# EAGLE design BotBoardUSB-R1 (EAGLE 4.16)
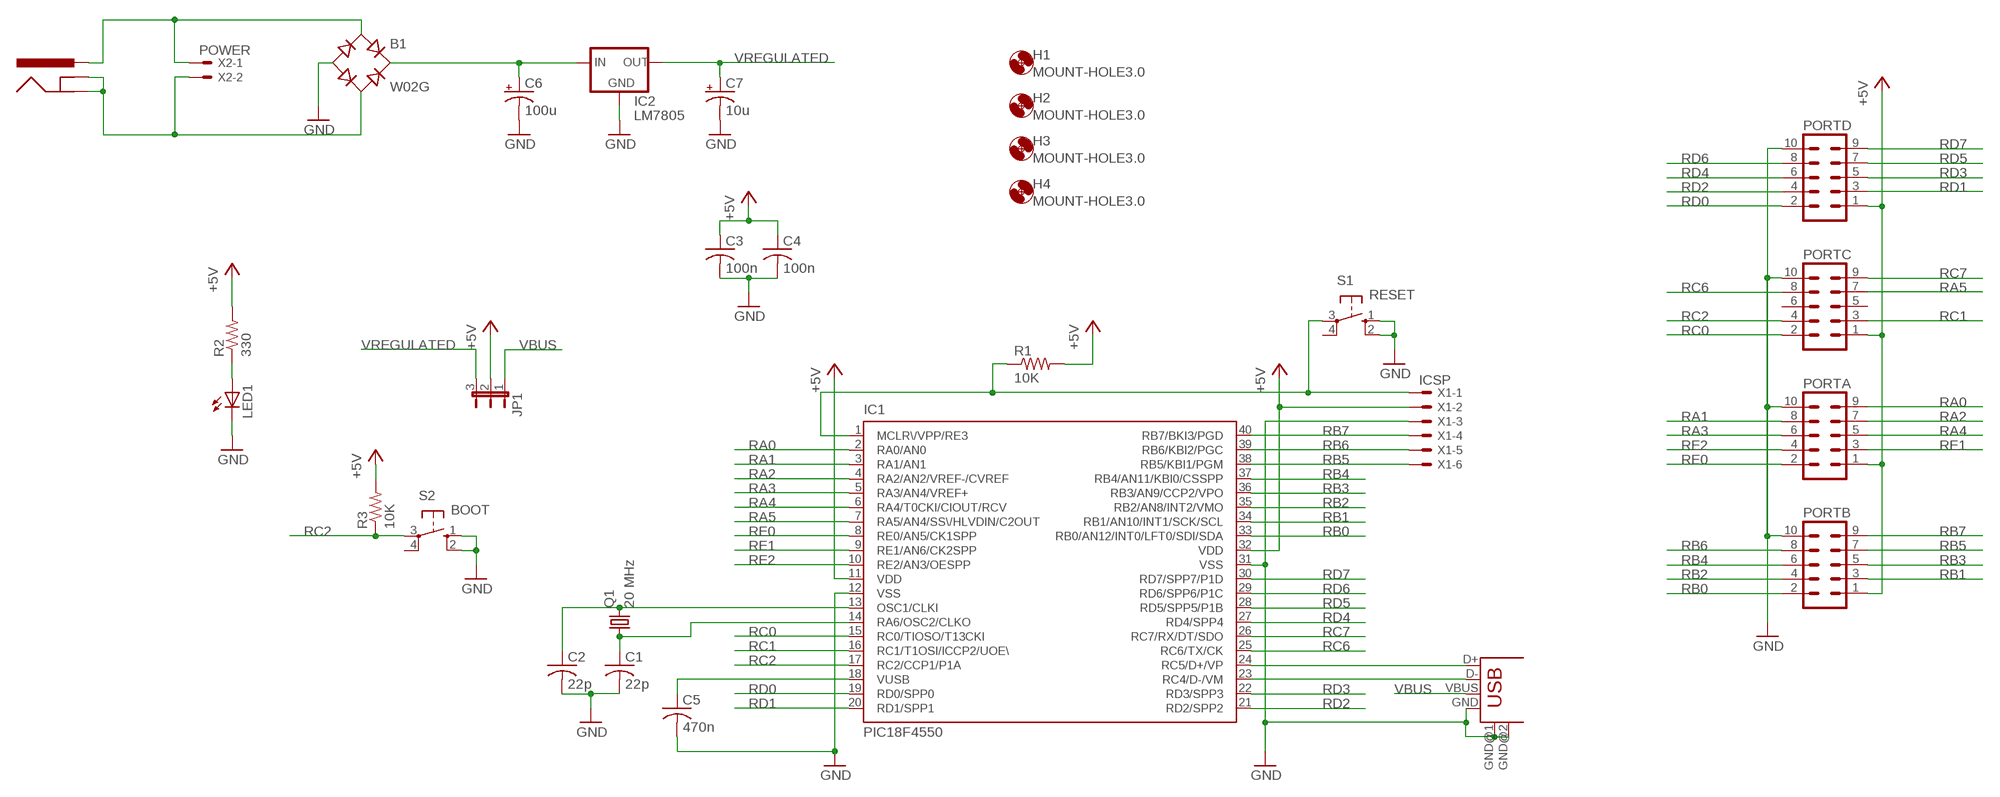
[diagram p0: schematic, sheet 1]

## Parts
B1  W02G  RECTIFIER-RB1A  [RB1A]
C1  22p  C-US025-025X050  [C025-025X050]
C2  22p  C-US025-025X050  [C025-025X050]
C3  100n  C-US050-025X075  [C050-025X075]
C4  100n  C-US050-025X075  [C050-025X075]
C5  470n  C-US050-025X075  [C050-025X075]
C6  100u  CPOL-USE2.5-7  [E2,5-7]
C7  10u  CPOL-USE2.5-5  [E2,5-5]
H1  MOUNT-HOLE3.0  [3,0]
H2  MOUNT-HOLE3.0  [3,0]
H3  MOUNT-HOLE3.0  [3,0]
H4  MOUNT-HOLE3.0  [3,0]
IC1  PIC18F4550  PIC18F4550_40  [DIL40]
IC2  LM7805  78MXXS  [78MXXS]
JP1  JP2E  [JP2]
LED1  LED5MM  [LED5MM]
PORTA  ML10  [ML10]
PORTB  ML10  [ML10]
PORTC  ML10  [ML10]
PORTD  ML10  [ML10]
Q1  20 MHz  CRYSTALHC49U-V  [HC49U-V]
R1  10K  R-US_0207/15  [0207/15]
R2  330  R-US_0207/2V  [0207/2V]
R3  10K  R-US_0207/10  [0207/10]
S1  RESET  10-XX  [B3F-10XX]
S2  BOOT  10-XX  [B3F-10XX]
X1  ICSP  22-23-2061  [22-23-2061]
X2  POWER  22-23-2021  [22-23-2021]
X3  POWER  POWER_JACKPTH  [POWER_JACK_PTH]
X4  USB  USB-B-H  [USB-B-H]

## Nets
+5V: C3.1 C4.1 IC1.11(VDD) IC1.32(VDD) JP1.2 PORTA.1 PORTB.1 PORTC.1 PORTD.1 R1.2 R2.2 R3.2 X1.2
GND: B1.- C1.2 C2.2 C3.2 C4.2 C5.2 C6.- C7.- IC1.12(VSS) IC1.31(VSS) IC2.GND LED1.K(C) PORTA.10 PORTB.10 PORTC.10 PORTD.10 S1.1(S) S1.2(S1) S2.1(S) S2.2(S1) X1.3 X4.GND X4.GND@1(GND) X4.GND@2(GND)
N$4: IC1.1(MCLR\/VPP/RE3) R1.1 S1.3(P) X1.1
N$5: C2.1 IC1.13(OSC1/CLKI) Q1.2
N$6: IC1.24(RC5/D+/VP) X4.D+
N$7: IC1.23(RC4/D-/VM) X4.D-
N$8: C1.1 IC1.14(RA6/OSC2/CLKO) Q1.1
N$9: B1.+ C6.+ IC2.IN
N$10: B1.AC2 X2.2 X3.GND X3.GND@1(GND)
N$11: B1.AC1 X2.1 X3.PWR
N$12: C5.1 IC1.18(VUSB)
N$13: LED1.A R2.1
RA0: IC1.2(RA0/AN0) PORTA.9
RA1: IC1.3(RA1/AN1) PORTA.8
RA2: IC1.4(RA2/AN2/VREF-/CVREF) PORTA.7
RA3: IC1.5(RA3/AN4/VREF+) PORTA.6
RA4: IC1.6(RA4/T0CKI/CIOUT/RCV) PORTA.5
RA5: IC1.7(RA5/AN4/SS\/HLVDIN/C2OUT) PORTC.7
RB0: IC1.33(RB0/AN12/INT0/LFT0/SDI/SDA) PORTB.2
RB1: IC1.34(RB1/AN10/INT1/SCK/SCL) PORTB.3
RB2: IC1.35(RB2/AN8/INT2/VMO) PORTB.4
RB3: IC1.36(RB3/AN9/CCP2/VPO) PORTB.5
RB4: IC1.37(RB4/AN11/KBI0/CSSPP) PORTB.6
RB5: IC1.38(RB5/KBI1/PGM) PORTB.7 X1.6
RB6: IC1.39(RB6/KBI2/PGC) PORTB.8 X1.5
RB7: IC1.40(RB7/BKI3/PGD) PORTB.9 X1.4
RC0: IC1.15(RC0/TIOSO/T13CKI) PORTC.2
RC1: IC1.16(RC1/T1OSI/ICCP2/UOE\) PORTC.3
RC2: IC1.17(RC2/CCP1/P1A) PORTC.4 R3.1 S2.3(P)
RC6: IC1.25(RC6/TX/CK) PORTC.8
RC7: IC1.26(RC7/RX/DT/SDO) PORTC.9
RD0: IC1.19(RD0/SPP0) PORTD.2
RD1: IC1.20(RD1/SPP1) PORTD.3
RD2: IC1.21(RD2/SPP2) PORTD.4
RD3: IC1.22(RD3/SPP3) PORTD.5
RD4: IC1.27(RD4/SPP4) PORTD.6
RD5: IC1.28(RD5/SPP5/P1B) PORTD.7
RD6: IC1.29(RD6/SPP6/P1C) PORTD.8
RD7: IC1.30(RD7/SPP7/P1D) PORTD.9
RE0: IC1.8(RE0/AN5/CK1SPP) PORTA.2
RE1: IC1.9(RE1/AN6/CK2SPP) PORTA.3
RE2: IC1.10(RE2/AN3/OESPP) PORTA.4
VBUS: JP1.1 X4.VBUS
VREGULATED: C7.+ IC2.OUT JP1.3
Unconnected: PORTC.5 PORTC.6 S1.4(P1) S2.4(P1)

## Library data of the parts
B1 = rectifier:RECTIFIER-: Rectifier
C1-C5 = rcl:C-US: CAPACITOR, American symbol
C6 C7 = rcl:CPOL-US: POLARIZED CAPACITOR, American symbol
H1-H4 = holes:MOUNT-HOLE: MOUNTING HOLE with drill center marker
IC1 = microchip:PIC18F4*_40: USB Microcontrollers with nanoWatt Technology High-Performance, Enhanced Flash, 28/40/44-Pin, Source: http://ww1.microchip.com/downloads/en/devicedoc/39632c.pdf
IC2 = v-reg:78MXXS: VOLTAGE REGULATOR
JP1 = jumper:JP2E: JUMPER
LED1 = led:LED: LED OSRAM: - CHIPLED LG R971, LG N971, LY N971, LG Q971, LY Q971, LO R971, LY R971 LH N974, LH R974 LS Q976, LO Q976, LY Q976 LO Q996 - Hyper CHIPLED LW Q18S LB Q993, LB Q99A, LB R99A - SideLED LS A670, LO A670, LY A670, LG A670, LP A670 LB A673, LV A673, LT A673, LW A673 LH A674 LY A675 LS A676, LA A676, LO A676, LY A676, LW A676 LS A679, LY A679, LG A679 - Hyper Micro SIDELED® LS Y876, LA Y876, LO Y876, LY Y876 LT Y87S - SmartLED LW L88C, LW L88S LB L89C, LB L89S, LG L890 LS L89K, LO L89K, LY L89K LS L896, LA L896, LO L896, LY L896 - TOPLED LS T670, LO T670, LY T670, LG T670, LP T670 LSG T670, LSP T670, LSY T670, LOP T670, LYG T670 LG T671, LOG T671, LSG T671 LB T673, LV T673, LT T673, LW T673 LH T674 LS T676, LA T676, LO T676, LY T676, LB T676, LH T676, LSB T676, LW T676 LB T67C, LV T67C, LT T67C, LS T67K, LO T67K, LY T67K, LW E67C LS E67B, LA E67B, LO E67B, LY E67B, LB E67C, LV E67C, LT E67C LW T67C LS T679, LY T679, LG T679 LS T770, LO T770, LY T770, LG T770, LP T770 LB T773, LV T773, LT T773, LW T773 LH T774 LS E675, LA E675, LY E675, LS T675 LS T776, LA T776, LO T776, LY T776, LB T776 LHGB T686 LT T68C, LB T68C - Hyper Mini TOPLED® LB M676 - Mini TOPLED Santana® LG M470 LS M47K, LO M47K, LY M47K Source: http://www.osram.convergy.de/
PORTA PORTB PORTC PORTD = con-harting-ml:ML10: HARTING
Q1 = crystal:CRYSTAL: CRYSTAL
R1-R3 = rcl:R-US_: RESISTOR, American symbol
S1 S2 = switch-omron:10-XX: OMRON SWITCH
X1 = con-molex:22-23-2061: .100" (2.54mm) Center Header - 6 Pin
X2 = con-molex:22-23-2021: .100" (2.54mm) Center Header - 2 Pin
X3 = SparkFun-3-2-07:POWER_JACK: Power Jack This is the standard 5.5mm barrel jack for power. The PTH is the most common, proven, reliable, footprint. All others are experimental. The Slot footprint only works if the mill layer is transmitted to the PCB fab house so be warned. Spark Fun Electronics SKU : PType-BPJ. Mating wall wart : Tools-PS
X4 = con-usb-2:USB: USB Connectors

## Board
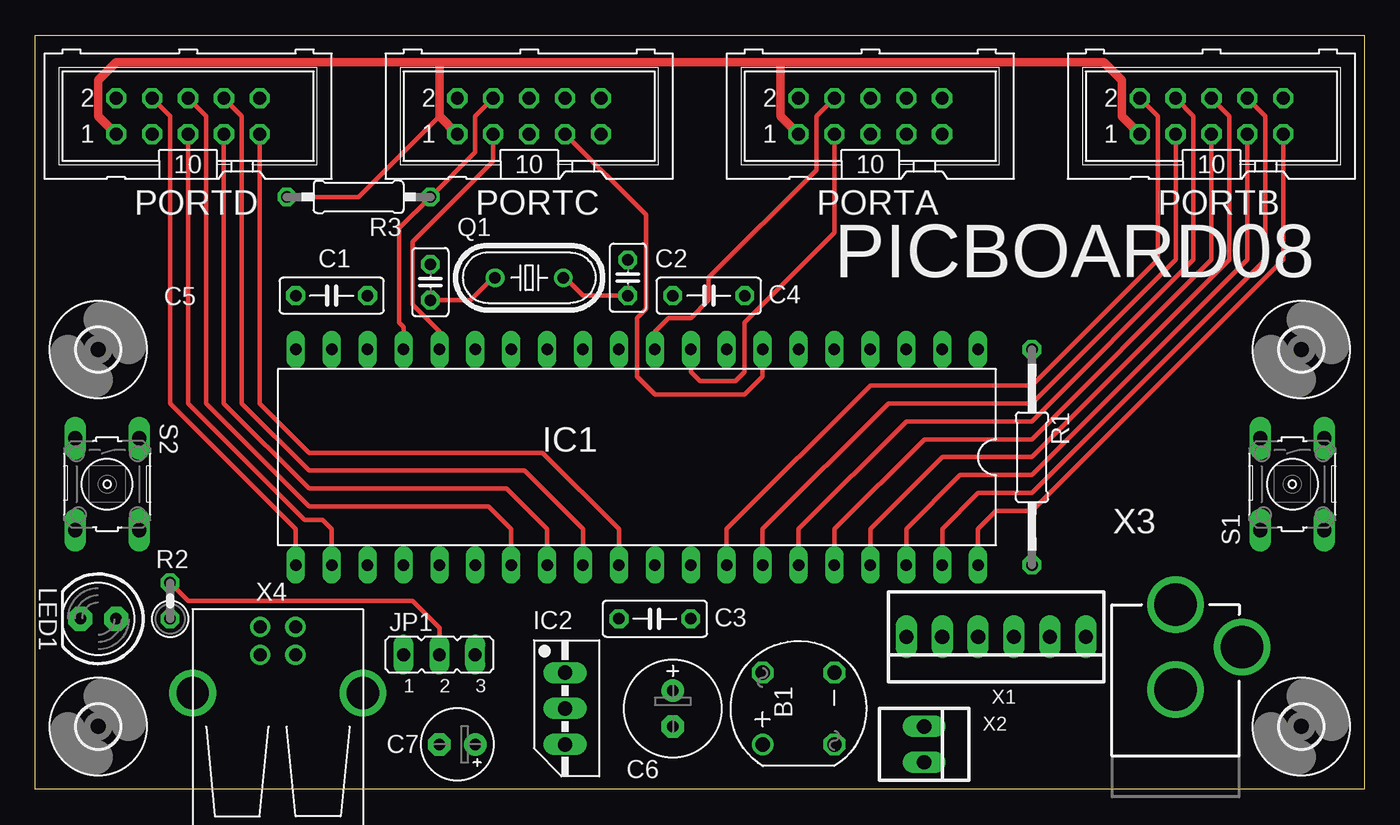
[diagram p1: board, top side]
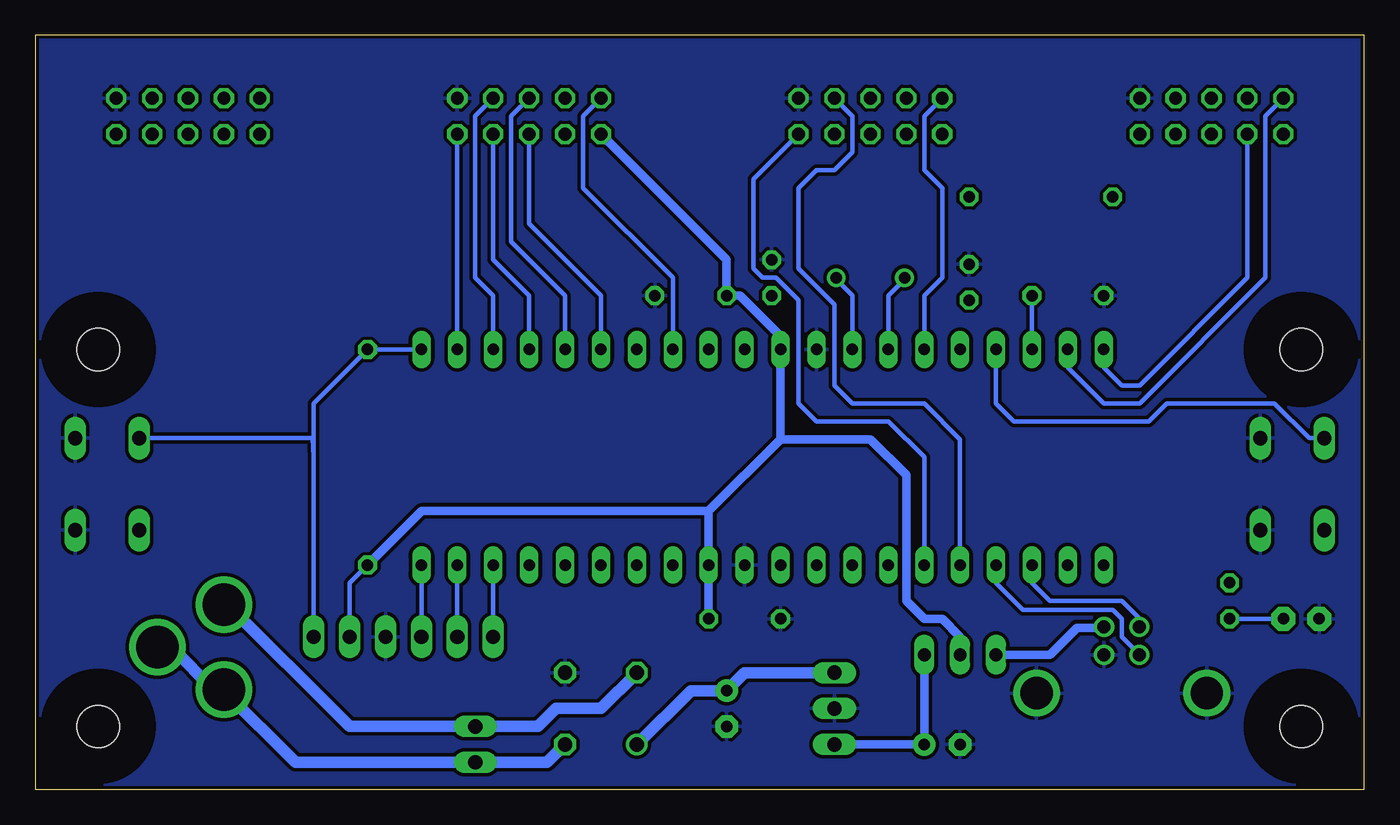
[diagram p2: board, bottom side, seen from below]

Size 93.98 x 53.34 mm. Coordinates in mm from the lower left corner, seen from the top.
Outline: 0,0 0,53.34 93.98,53.34 93.98,0 0,0
Copper layers (1*16): Top 0.035mm / dielectric 1.5mm / Bottom 0.035mm
Design rules "default": minimum track width 10mil, minimum drill 24mil, track to track 10mil, track to pad 10mil, pad to pad 10mil, via to via 10mil, smd to smd 10mil, copper to edge 10mil, drill to drill 8mil, minimum pad ring 10mil, minimum via ring 8mil, stop-mask expansion 4mil, vias tented up to drill 0mil, thermal gap 10mil

### Footprints (pad centres in the part's own frame; a part is rotated, then mirrored left to right if it is on the bottom)
RB1A = drill 1.016 round: + -2.54,2.54 | drill 1.016 octagon: - 2.54,-2.54; AC1 2.54,2.54; AC2 -2.54,-2.54
C025-025X050 = drill 0.813 octagon: 1 -1.27,0; 2 1.27,0
C050-025X075 = drill 0.813 octagon: 1 -2.54,0; 2 2.54,0
E2,5-7 = drill 0.813 pad 1.6 round: + -1.27,0 | drill 0.813 pad 1.6 octagon: - 1.27,0
E2,5-5 = drill 0.813 pad 1.6 round: + -1.27,0 | drill 0.813 pad 1.6 octagon: - 1.27,0
3,0 = hole 3: 0,0
DIL40 = drill 0.813 long: 1 -24.13,-7.62; 2 -21.59,-7.62; 3 -19.05,-7.62; 4 -16.51,-7.62; 5 -13.97,-7.62; 6 -11.43,-7.62; 7 -8.89,-7.62; 8 -6.35,-7.62; 9 -3.81,-7.62; 10 -1.27,-7.62; 11 1.27,-7.62; 12 3.81,-7.62; 13 6.35,-7.62; 14 8.89,-7.62; 15 11.43,-7.62; 16 13.97,-7.62; 17 16.51,-7.62; 18 19.05,-7.62; 19 21.59,-7.62; 20 24.13,-7.62; 21 24.13,7.62; 22 21.59,7.62; 23 19.05,7.62; 24 16.51,7.62; 25 13.97,7.62; 26 11.43,7.62; 27 8.89,7.62; 28 6.35,7.62; 29 3.81,7.62; 30 1.27,7.62; 31 -1.27,7.62; 32 -3.81,7.62; 33 -6.35,7.62; 34 -8.89,7.62; 35 -11.43,7.62; 36 -13.97,7.62; 37 -16.51,7.62; 38 -19.05,7.62; 39 -21.59,7.62; 40 -24.13,7.62
78MXXS = drill 1.016 long: GND 0,-2.54; IN -2.54,-2.54; OUT 2.54,-2.54
JP2 = drill 0.914 long: 1 -2.54,0; 2 0,0; 3 2.54,0
LED5MM = drill 0.813 pad 1.676 octagon: A -1.27,0; K 1.27,0
ML10 = drill 0.914 octagon: 1 -5.08,-1.27; 2 -5.08,1.27; 3 -2.54,-1.27; 4 -2.54,1.27; 5 0,-1.27; 6 0,1.27; 7 2.54,-1.27; 8 2.54,1.27; 9 5.08,-1.27; 10 5.08,1.27
HC49U-V = drill 0.813 round: 1 -2.413,0; 2 2.413,0
0207/15 = drill 0.813 octagon: 1 -7.62,0; 2 7.62,0
0207/2V = drill 0.813 octagon: 1 -1.27,0; 2 1.27,0
0207/10 = drill 0.813 octagon: 1 -5.08,0; 2 5.08,0
B3F-10XX = drill 1.016 long: 1 -3.251,2.261; 2 3.251,2.261; 3 -3.251,-2.261; 4 3.251,-2.261
22-23-2061 = drill 1 long: 1 -6.35,0; 2 -3.81,0; 3 -1.27,0; 4 1.27,0; 5 3.81,0; 6 6.35,0
22-23-2021 = drill 1 long: 1 -1.27,0; 2 1.27,0
POWER_JACK_PTH = drill 2.997 round: GND 0,7.7; GND@1 4.7,10.7; PWR 0,13.7
USB-B-H = drill 0.914 round: D+ 0,1.25; D- 1.981,1.25; GND 0,-1.25; VBUS 1.981,-1.25 | drill 2.286 round: GND@1 -2.718,6.02; GND@2 -2.718,-6.02

### Placement (x,y rotation side)
B1  53.98,5.71 90 top
C1  27.94,35.88 90 top
C2  41.91,36.2 90 top
C3  43.81,12.06 180 top
C4  47.62,34.92 0 top
C5  20.95,34.92 180 top
C6  45.09,5.71 270 top
C7  29.84,3.17 180 top
H1  89.53,4.45 0 top
H2  4.45,4.45 0 top
H3  89.53,31.11 0 top
H4  4.45,31.11 0 top
IC1  42.55,23.5 180 top
IC2  40.01,5.71 270 top
JP1  28.57,9.53 0 top
LED1  4.45,12.06 180 top
PORTA  59.05,47.62 0 top
PORTB  83.19,47.62 0 top
PORTC  34.92,47.62 0 top
PORTD  10.79,47.62 0 top
Q1  34.92,36.2 0 top
R1  70.48,23.5 270 top
R2  9.53,13.34 90 top
R3  22.86,41.91 180 top
S1  88.9,21.59 270 top
S2  5.08,21.59 270 top
X1  67.94,10.79 180 top
X2  62.87,3.17 270 top
X3  80.64,-0.64 0 top
X4  17.14,9.53 90 top

### Tracks (layer width: path | path; a pad name or v marks a point on that pad's centre or on a via)
+5V
  Top 0.305: R3.2 22.86,41.91 28.57,47.62 | JP1.2 28.57,11.43 26.67,13.34 10.79,13.34 R2.2
  Top 0.61: PORTD.1 4.45,47.62 4.45,50.16 5.71,51.44 28.57,51.44 | 52.7,51.44 28.57,51.44 | 52.7,51.44 75.56,51.44 76.83,50.16 76.83,47.62 PORTB.1 | PORTA.1 52.7,47.62 52.7,51.44 | PORTC.1 28.57,47.62 28.57,51.44
  Bottom 0.305: X1.2 71.75,14.61 R1.2
  Bottom 0.61: C3.1 IC1.32 46.35,19.68 | 41.27,24.77 46.35,19.68 | 41.27,24.77 IC1.11 41.27,32.07 44.13,34.92 C4.1 45.09,37.47 PORTA.1 | R1.2 66.67,19.68 46.35,19.68 | JP1.2 28.57,10.79 29.84,12.06 31.11,12.06 32.38,13.34 32.38,22.23 34.92,24.77 41.27,24.77
GND
  pour Bottom: -0.64,-0.64 -0.64,53.98 94.61,53.98 94.61,-0.64
N$4
  Bottom 0.305: IC1.1 R1.1 74.3,27.3 74.3,23.5 | X1.1 74.3,23.5 | S1.3 74.37,24.84 74.3,23.5
N$5
  Top 0.305: C2.1 38.73,34.92 37.47,36.2
  Top 0.406: Q1.2 37.47,36.2
  Bottom 0.305: Q1.2 37.47,36.2 36.2,34.92 IC1.13
N$6
  Bottom 0.305: X4.D+ 15.89,9.54 17.14,10.79 17.14,12.06 17.78,12.7 24.13,12.7 26.04,14.61 IC1.24
N$7
  Bottom 0.305: 23.52,15.86 IC1.23 23.5,14.61 22.23,13.34 17.14,13.34 15.89,12.09 X4.D-
N$8
  Top 0.305: Q1.1 32.38,36.2 30.8,34.61 C1.1
  Bottom 0.305: IC1.14 33.66,34.92 32.38,36.2
  Bottom 0.406: Q1.1 32.38,36.2
N$9
  Bottom 0.813: IC2.IN 43.81,8.26 C6.+ 47.62,6.99 B1.+
N$10
  Bottom 0.61: 80.64,6.99 X3.GND
  Bottom 0.813: B1.AC2 57.78,1.91 X2.2 75.56,1.91 80.64,6.99 81.28,6.99 84.36,10.06 X3.GND@1
N$11
  Bottom 0.813: B1.AC1 53.98,5.71 57.15,5.71 58.42,4.45 X2.1 71.75,4.45 80.64,13.34 X3.PWR
N$12
  Bottom 0.305: IC1.18 C5.1
N$13
  Bottom 0.305: LED1.A R2.1
RA0
  Bottom 0.305: IC1.2 PORTA.9
RA1
  Bottom 0.305: IC1.3 61.59,34.92 62.87,36.2 62.87,47.62 PORTA.8
RA2
  Bottom 0.305: IC1.4 59.05,34.92 61.59,37.47 PORTA.7
RA3
  Bottom 0.305: IC1.5 56.52,34.92 60.33,38.73 60.33,47.62 PORTA.6
RA4
  Bottom 0.305: IC1.6 53.98,34.92 59.05,40.01 PORTA.5
RA5
  Top 0.305: IC1.7 51.44,29.21 50.16,27.94 43.81,27.94 42.55,29.21 42.55,33.34 43.18,33.97 43.18,40.64 PORTC.7
RB0
  Top 0.305: IC1.33 48.9,18.41 59.05,28.57 70.48,28.57 79.38,37.47 79.38,47.62 PORTB.2
RB1
  Top 0.305: IC1.34 51.44,18.41 60.33,27.3 70.48,27.3 80.64,37.47 PORTB.3
RB2
  Top 0.305: IC1.35 53.98,18.41 61.59,26.04 70.48,26.04 81.92,37.47 81.92,47.62 PORTB.4
RB3
  Top 0.305: IC1.36 56.52,18.41 62.87,24.77 70.48,24.77 83.19,37.47 PORTB.5
RB4
  Top 0.305: IC1.37 59.05,18.41 64.14,23.5 70.48,23.5 84.45,37.47 84.45,47.62 PORTB.6
RB5
  Top 0.305: IC1.38 61.59,18.41 65.41,22.23 70.48,22.23 85.72,37.47 PORTB.7
  Bottom 0.305: X1.6 IC1.38
RB6
  Top 0.305: IC1.39 64.14,18.41 66.67,20.95 70.48,20.95 87,37.47 87,47.62 PORTB.8
  Bottom 0.305: X1.5 IC1.39
RB7
  Top 0.305: PORTB.9 88.27,37.47 70.48,19.68 67.94,19.68 66.67,18.41 IC1.40
  Bottom 0.305: X1.4 IC1.40
RC0
  Bottom 0.305: PORTC.2 31.11,47.62 31.11,43.81 29.84,42.55 29.84,36.2 31.11,34.92 IC1.15
RC1
  Top 0.305: IC1.16 28.57,32.38 26.67,34.29 26.67,38.73 32.38,44.45 PORTC.3
RC2
  Top 0.305: IC1.17 26.04,32.7 25.72,33.02 25.72,39.69 R3.1 31.11,45.09 31.11,47.62 PORTC.4
  Bottom 0.305: S2.3 3.89,24.84 6.35,27.3 13.97,27.3 15.24,26.04 24.77,26.04 26.04,27.3 IC1.17
RC6
  Bottom 0.305: IC1.25 28.57,24.77 31.11,27.3 36.2,27.3 37.47,28.57 37.47,34.29 40.01,36.83 40.01,42.55 38.73,43.81 37.47,43.81 36.2,45.09 36.2,47.62 PORTC.8
RC7
  Bottom 0.305: IC1.26 31.11,23.5 33.66,26.04 38.73,26.04 40.01,27.3 40.01,34.61 41.59,36.2 42.55,36.2 43.18,36.83 43.18,43.18 PORTC.9
RD0
  Bottom 0.305: IC1.19 20.95,29.84 18.41,27.3 15.88,27.3 6.99,36.2 6.99,47.62 PORTD.2
RD1
  Bottom 0.305: IC1.20 18.41,29.84 17.14,28.57 15.88,28.57 8.26,36.2 PORTD.3
RD2
  Top 0.305: IC1.21 18.41,18.41 9.53,27.3 9.53,47.62 PORTD.4
RD3
  Top 0.305: PORTD.5 10.79,27.3 19.05,19.05 20.32,19.05 20.95,18.41 IC1.22
RD4
  Top 0.305: IC1.27 33.66,18.41 32.07,20 19.37,20 12.06,27.3 12.06,47.62 PORTD.6
RD5
  Top 0.305: IC1.28 36.2,18.41 33.34,21.27 19.37,21.27 13.34,27.3 PORTD.7
RD6
  Top 0.305: IC1.29 38.73,18.41 34.61,22.54 19.37,22.54 14.61,27.3 14.61,47.62 PORTD.8
RD7
  Top 0.305: IC1.30 41.27,18.41 35.88,23.81 19.37,23.81 15.88,27.3 PORTD.9
RE0
  Bottom 0.305: PORTA.2 55.24,47.62 55.24,42.55 48.9,36.2 IC1.8
RE1
  Top 0.305: PORTA.3 56.52,42.23 56.52,39.37 50.16,33.02 50.16,29.53 49.53,28.89 46.99,28.89 46.35,29.53 IC1.9
RE2
  Top 0.305: IC1.10 43.81,32.38 44.77,33.34 46.35,33.34 47.62,34.61 47.62,36.2 55.24,43.81 55.24,47.62 PORTA.4
VBUS
  Bottom 0.61: 26.02,9.51 JP1.1 22.23,9.53 20.32,11.43 18.41,11.43 18.39,11.45 X4.VBUS
VREGULATED
  Bottom 0.61: JP1.3 C7.+ IC2.OUT

### Text on the board
tNames: PICBOARD08